# Altium schematic sheet arduinoNew.SchDoc
size 264 x 383 mm
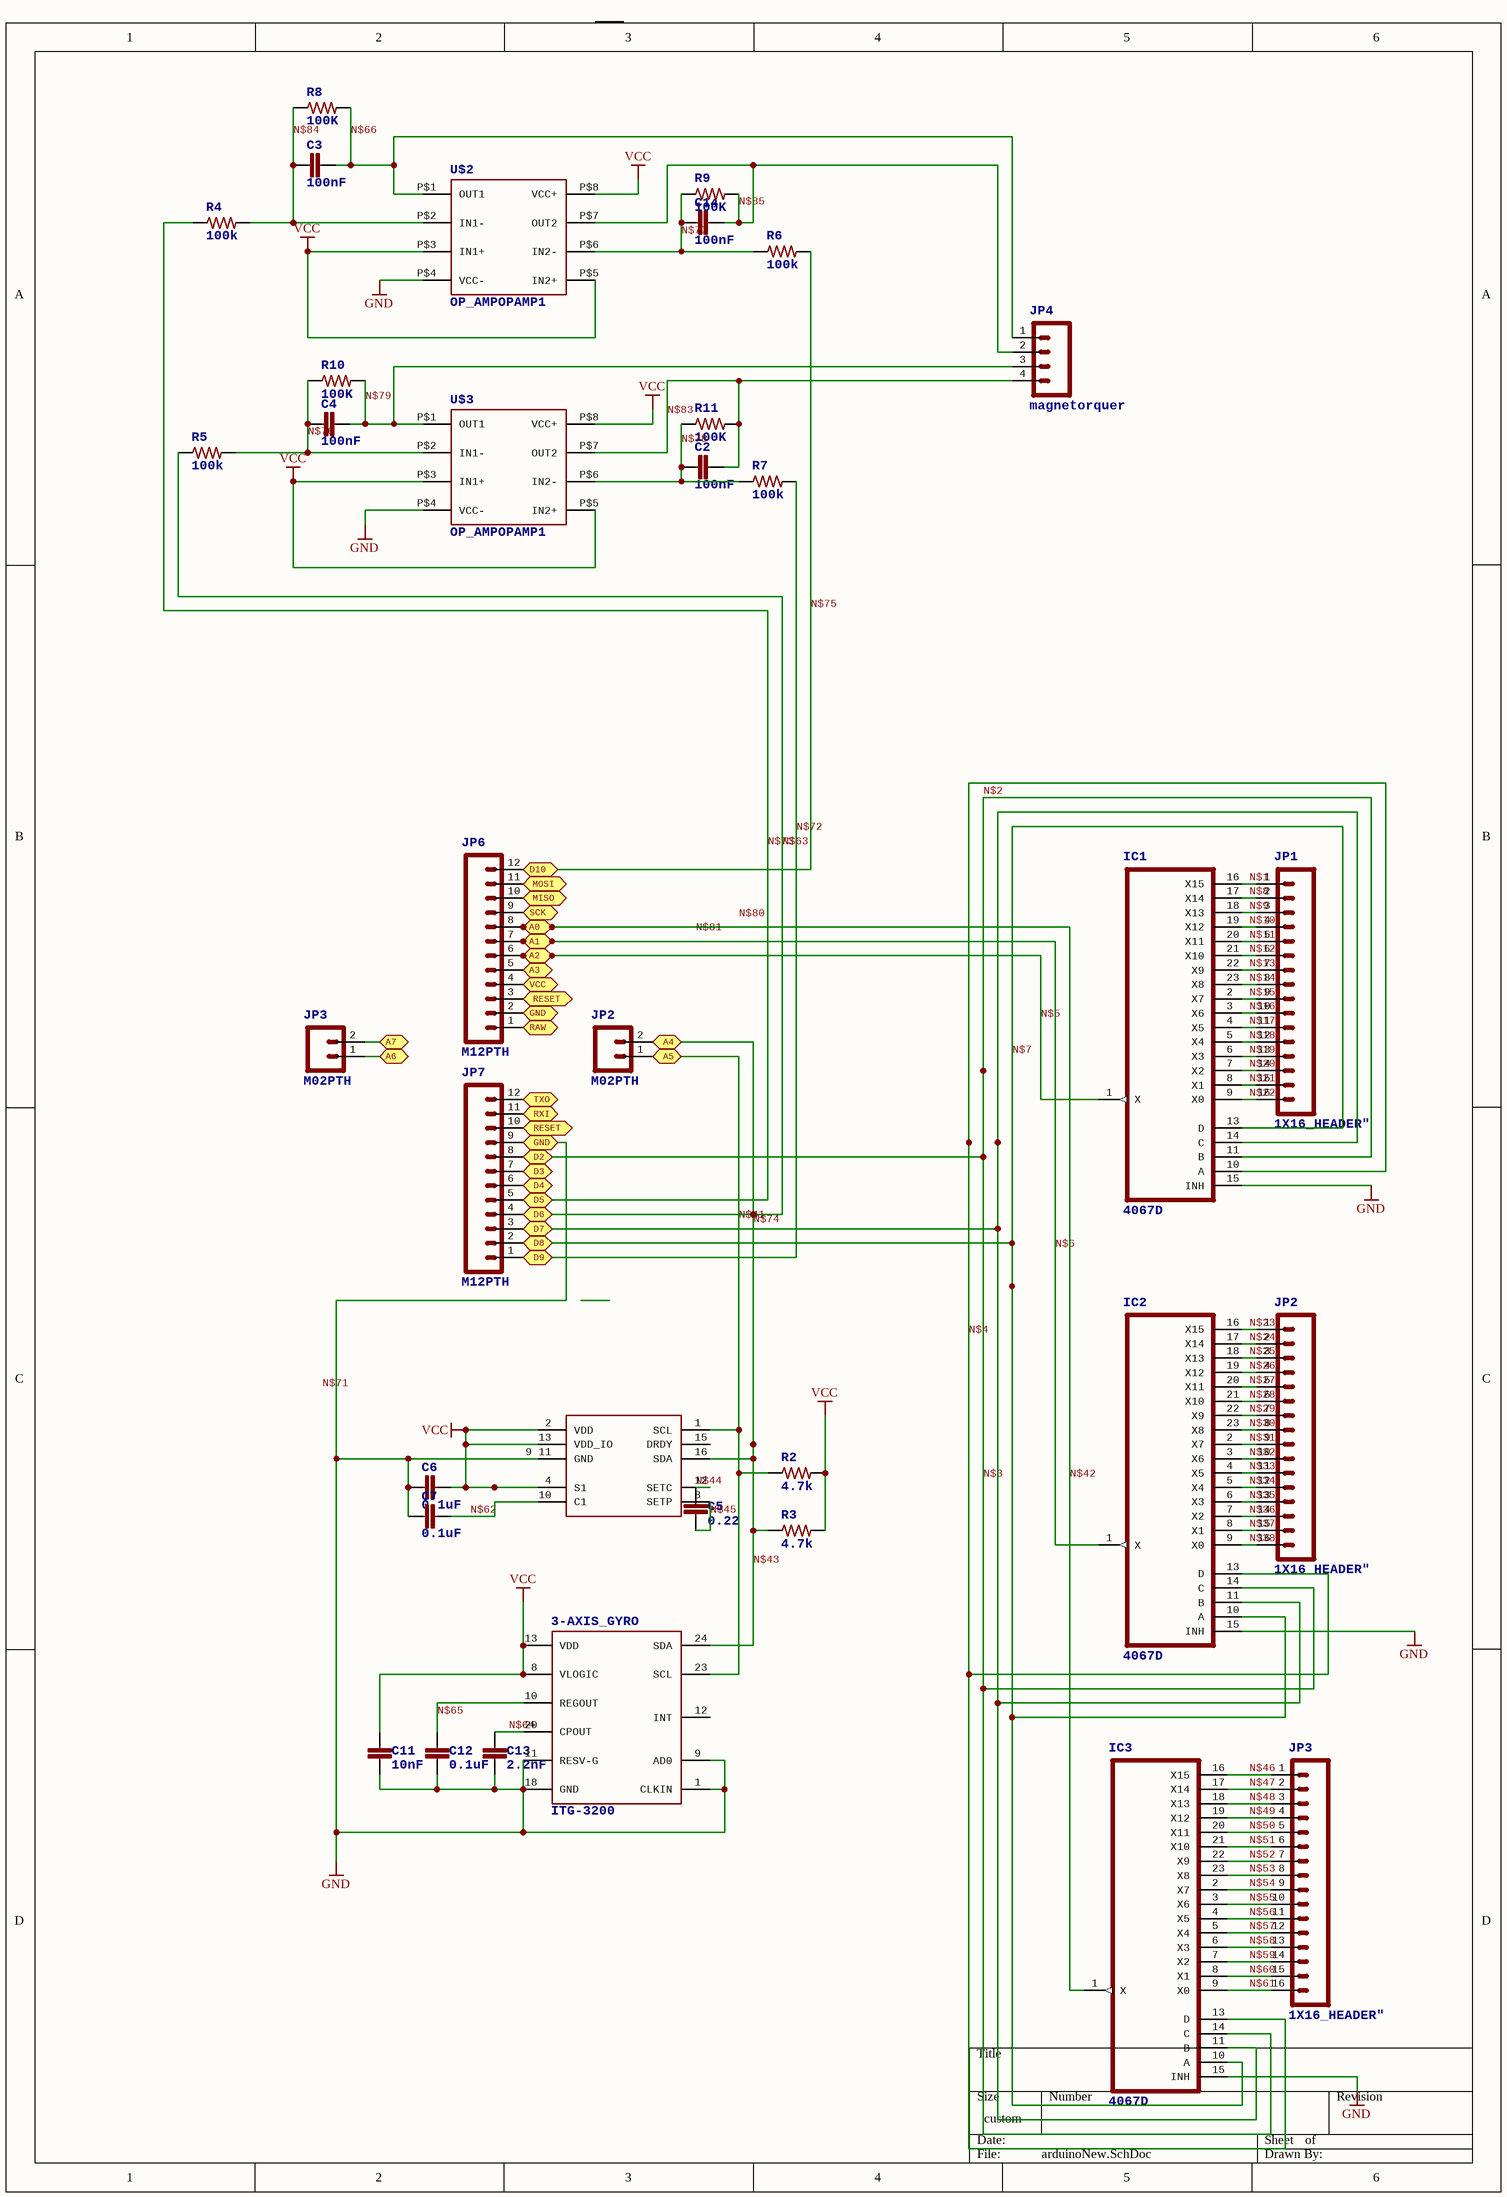
[diagram p0: arduinoNew.SchDoc]

## Parts
(Parts that share a designator on the sheet are numbered #1, #2 ... from top to bottom, then left to right.)
3-AXIS_GYRO  ITG-3200  [QFN-24]
3-AXIS_MAG  HMC5883L  [LPCC16]  (value not drawn)
C2  100nF  [0402-CAP]
C3  100nF  [0402-CAP]
C4  100nF  [0402-CAP]
C5  0.22  [0402-CAP]
C6  0.1uF  [0402-CAP]
C7  0.1uF  [0402-CAP]
C11  10nF  [0402-CAP]
C12  0.1uF  [0402-CAP]
C13  2.2nF  [0402-CAP]
C14  100nF  [0402-CAP]
IC1  4067D  [SO24W]
IC2  4067D  [SO24W]
IC3  4067D  [SO24W]
JP1  1X16_HEADER"  [1X16_HEADER]
JP2#1  M02PTH  [1X02]
JP2#2  1X16_HEADER"  [1X16_HEADER]
JP3#1  M02PTH  [1X02]
JP3#2  1X16_HEADER"  [1X16_HEADER]
JP4  magnetorquer  [1X04_HEADER]
JP6  M12PTH  [1X12]
JP7  M12PTH  [1X12]
R2  4.7k  [0805]
R3  4.7k  [0805]
R4  100k  [0805]
R5  100k  [0805]
R6  100k  [0805]
R7  100k  [0805]
R8  100K  [0805]
R9  100K  [0805]
R10  100K  [0805]
R11  100K  [0805]
U$2  OP_AMPOPAMP1  [OPAMP]
U$3  OP_AMPOPAMP1  [OPAMP]

## Ports
A0, A1, A2, A3, A4, A5, A6, A7, D2, D3, D4, D5, D6, D7, D8, D9, D10, GND, MISO, MOSI, RAW, RESET, RXI, SCK, TXO, VCC

## Nets
GND: 3-AXIS_GYRO.1(CLKIN) 3-AXIS_GYRO.9(AD0) 3-AXIS_GYRO.11(RESV-G) 3-AXIS_GYRO.18(GND) 3-AXIS_MAG.9_11(GND) C6.1 C7.1 C11.2 C12.2 C13.2 IC1.15(INH) IC2.15(INH) IC3.15(INH) JP6.2 JP7.9 U$2.P$4(VCC-) U$3.P$4(VCC-) ; port GND
VCC: 3-AXIS_GYRO.8(VLOGIC) 3-AXIS_GYRO.13(VDD) 3-AXIS_MAG.2(VDD) 3-AXIS_MAG.4(S1) 3-AXIS_MAG.13(VDD_IO) C6.2 C11.1 R2.2 R3.2 U$2.P$3(IN1+) U$2.P$5(IN2+) U$2.P$8(VCC+) U$3.P$3(IN1+) U$3.P$5(IN2+) U$3.P$8(VCC+)
A3: JP6.5 ; port A3
A6: JP3#1.1 ; port A6
A7: JP3#1.2 ; port A7
D3: JP7.7 ; port D3
D4: JP7.6 ; port D4
D7: IC1.14(C) IC2.11(B) IC3.11(B) JP7.3 ; port D7
MISO: JP6.10 ; port MISO
MOSI: JP6.11 ; port MOSI
N$1: IC1.16(X15) JP1.1
N$2: IC1.11(B) IC2.14(C) IC3.14(C) JP7.8 ; port D2  [also labelled N$3]
N$4: IC1.10(A) IC2.13(D) IC3.13(D)
N$5: IC1.1(X) JP6.6 ; port A2
N$6: IC2.1(X) JP6.7 ; port A1
N$7: IC1.13(D) IC2.10(A) IC3.10(A) JP7.2 ; port D8
N$8: IC1.17(X14) JP1.2
N$9: IC1.18(X13) JP1.3
N$10: IC1.19(X12) JP1.4
N$11: IC1.20(X11) JP1.5
N$12: IC1.21(X10) JP1.6
N$13: IC1.22(X9) JP1.7
N$14: IC1.23(X8) JP1.8
N$15: IC1.2(X7) JP1.9
N$16: IC1.3(X6) JP1.10
N$17: IC1.4(X5) JP1.11
N$18: IC1.5(X4) JP1.12
N$19: IC1.6(X3) JP1.13
N$20: IC1.7(X2) JP1.14
N$21: IC1.8(X1) JP1.15
N$22: IC1.9(X0) JP1.16
N$23: IC2.16(X15) JP2#2.1
N$24: IC2.17(X14) JP2#2.2
N$25: IC2.18(X13) JP2#2.3
N$26: IC2.19(X12) JP2#2.4
N$27: IC2.20(X11) JP2#2.5
N$28: IC2.21(X10) JP2#2.6
N$29: IC2.22(X9) JP2#2.7
N$30: IC2.23(X8) JP2#2.8
N$31: IC2.2(X7) JP2#2.9
N$32: IC2.3(X6) JP2#2.10
N$33: IC2.4(X5) JP2#2.11
N$34: IC2.5(X4) JP2#2.12
N$35: IC2.6(X3) JP2#2.13
N$36: IC2.7(X2) JP2#2.14
N$37: IC2.8(X1) JP2#2.15
N$38: IC2.9(X0) JP2#2.16
N$41: 3-AXIS_GYRO.23(SCL) 3-AXIS_MAG.1(SCL) JP2#1.1 R2.1 ; port A5
N$42: IC3.1(X) JP6.8 ; port A0
N$43: 3-AXIS_GYRO.24(SDA) 3-AXIS_MAG.16(SDA) JP2#1.2 JP7.4 R3.1 R5.1 ; port D6, port A4  [also labelled N$63, N$74]
N$44: 3-AXIS_MAG.12(SETC) C5.1
N$45: 3-AXIS_MAG.8(SETP) C5.2
N$46: IC3.16(X15) JP3#2.1
N$47: IC3.17(X14) JP3#2.2
N$48: IC3.18(X13) JP3#2.3
N$49: IC3.19(X12) JP3#2.4
N$50: IC3.20(X11) JP3#2.5
N$51: IC3.21(X10) JP3#2.6
N$52: IC3.22(X9) JP3#2.7
N$53: IC3.23(X8) JP3#2.8
N$54: IC3.2(X7) JP3#2.9
N$55: IC3.3(X6) JP3#2.10
N$56: IC3.4(X5) JP3#2.11
N$57: IC3.5(X4) JP3#2.12
N$58: IC3.6(X3) JP3#2.13
N$59: IC3.7(X2) JP3#2.14
N$60: IC3.8(X1) JP3#2.15
N$61: IC3.9(X0) JP3#2.16
N$62: 3-AXIS_MAG.10(C1) C7.2
N$64: 3-AXIS_GYRO.20(CPOUT) C13.1
N$65: 3-AXIS_GYRO.10(REGOUT) C12.1
N$66: C3.2 JP4.1 R8.2 U$2.P$1(OUT1)
N$72: JP7.1 R7.2 ; port D9
N$73: JP7.5 R4.1 ; port D5
N$75: JP6.12 R6.2 ; port D10
N$76: C4.1 R5.2 R10.1 U$3.P$2(IN1-)
N$77: C14.1 R6.1 R9.1 U$2.P$6(IN2-)
N$78: C2.1 R7.1 R11.1 U$3.P$6(IN2-)
N$79: C4.2 JP4.3 R10.2 U$3.P$1(OUT1)
N$83: C2.2 JP4.4 R11.2 U$3.P$7(OUT2)
N$84: C3.1 R4.2 R8.1 U$2.P$2(IN1-)
N$85: C14.2 JP4.2 R9.2 U$2.P$7(OUT2)
RAW: JP6.1 ; port RAW
RESET: JP6.3 JP7.10 ; port RESET
RXI: JP7.11 ; port RXI
SCK: JP6.9 ; port SCK
TXO: JP7.12 ; port TXO
VCC: JP6.4 ; port VCC  [a separate net that carries the same name]

Not connected (* = marked no-connect by the designer): 3-AXIS_GYRO 12(INT); 3-AXIS_MAG 15(DRDY)

## Notes on the sheet
- Labels drawn without touching a wire or pin: N$71, N$80, N$81

## Library data of the parts
3-AXIS_GYRO = ITG-3200: ITG-3200 3-axis gyro, digital output, qfn24 package
C2-C7 C11-C14 = CAP0402-CAP: CapacitorStandard 0603 ceramic capacitor, and 0.1" leaded capacitor.
IC1-IC3 = 4067D: 16-channel ANALOG MULTIPLEXER
JP2#1 JP3#1 = M02PTH: Header 2Standard 2-pin 0.1" header. Use with straight break away headers (SKU : PRT-00116), right angle break away headers (PRT-00553), swiss pins (PRT-00743), machine pins (PRT-00117), and female headers (PRT-00115). Molex polarized connector foot print use with SKU : PRT-08233 with associated crimp pins and housings.
JP4 = 1X04_HEADER": Header 4Standard 4-pin 0.1" header. Use with straight break away headers (SKU : PRT-00116), right angle break away headers (PRT-00553), swiss pins (PRT-00743), machine pins (PRT-00117), and female headers (PRT-00115). Molex polarized connector foot print use with SKU : PRT-08231 with associated crimp pins and housings.
JP6 JP7 = M12PTH: Header 12Standard 12-pin 0.1" header. Use with straight break away headers (SKU : PRT-00116), right angle break away headers (PRT-00553), swiss pins (PRT-00743), machine pins (PRT-00117), and female headers (PRT-00115).
R2-R11 = RESISTOR: ResistorBasic schematic elements and footprints for 0603, 1206, and PTH 1/10th watt (small) resistors.